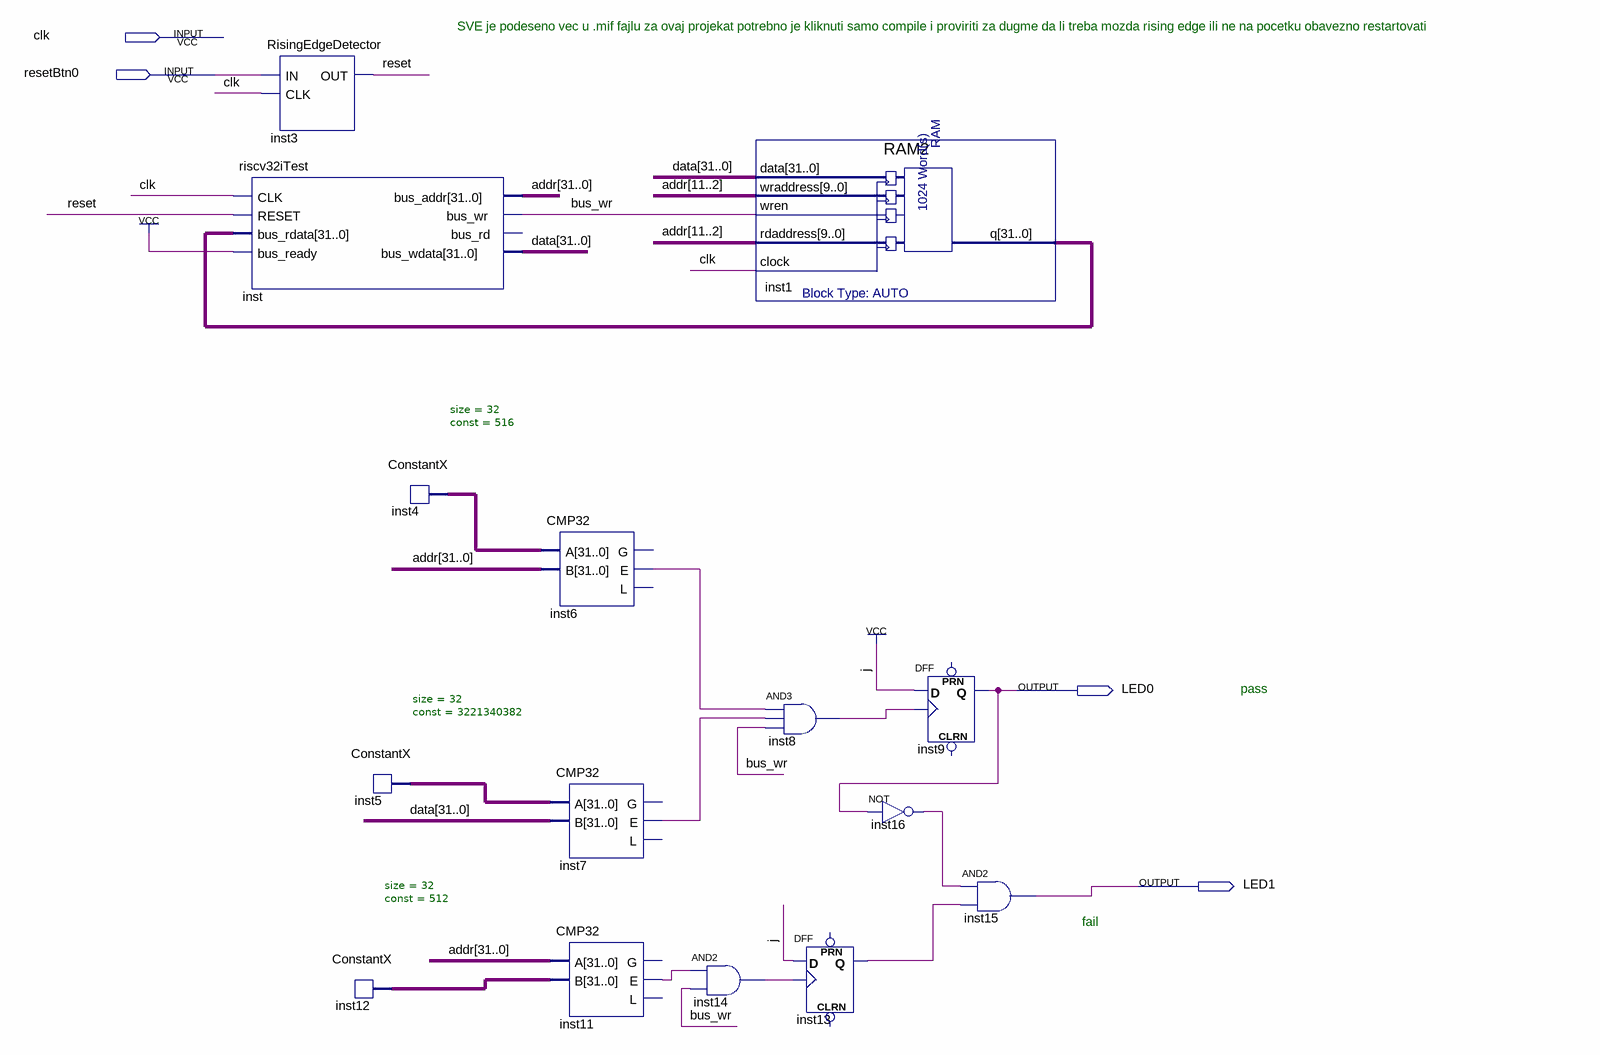
[diagram p0: schematic sheet]
// Quartus schematic CPUTest.bdf as structural Verilog: 15 symbols, 4 pins
module CPUTest (
  input  clk,
  input  resetBtn0,
  output LED0,
  output LED1
);

  wire bus_wr, inst6_e, inst7_e, inst8_out, inst11_e, inst13_q, inst14_out, inst16_out, reset;
  wire [31:0] addr, data, inst1_q, inst4_data_out, inst5_data_out, inst12_data_out;

  riscv32iTest inst (
    .CLK(clk), .RESET(reset), .bus_rdata(inst1_q), .bus_ready(1'b1), .bus_addr(addr), .bus_wr(bus_wr),
    .bus_wdata(data));  // open: bus_rd
  RisingEdgeDetector inst3 (.IN(resetBtn0), .CLK(clk), .OUT(reset));
  ConstantX #(.size(32), .\const (512)) inst12 (.DATA_OUT(inst12_data_out));
  ConstantX #(.size(32), .\const (516)) inst4 (.DATA_OUT(inst4_data_out));
  ConstantX #(.size(32), .\const (3221340382)) inst5 (.DATA_OUT(inst5_data_out));
  CMP32 inst6 (.A(inst4_data_out), .B(addr), .E(inst6_e));  // open: G, L
  CMP32 inst7 (.A(inst5_data_out), .B(data), .E(inst7_e));  // open: G, L
  CMP32 inst11 (.A(addr), .B(inst12_data_out), .E(inst11_e));  // open: G, L
  and inst14 (inst14_out, inst11_e, bus_wr);
  RAM2 inst1 (.data(data), .wraddress(addr[11:2]), .wren(bus_wr), .rdaddress(addr[11:2]), .clock(clk), .q(inst1_q));
  and inst8 (inst8_out, inst6_e, inst7_e, bus_wr);
  DFF inst13 (.CLK(inst14_out), .D(1'b1), .Q(inst13_q));  // open: CLRN, PRN
  DFF inst9 (.CLK(inst8_out), .D(1'b1), .Q(LED0));  // open: CLRN, PRN
  not inst16 (inst16_out, LED0);
  and inst15 (LED1, inst16_out, inst13_q);

  // Notes on the sheet:
  //   SVE je podeseno vec u .mif fajlu za ovaj projekat potrebno je kliknuti samo compile i proviriti za dugme da li treba mozda rising edge ili ne na pocetku obavezno restartovati
  //   pass
  //   fail
endmodule
